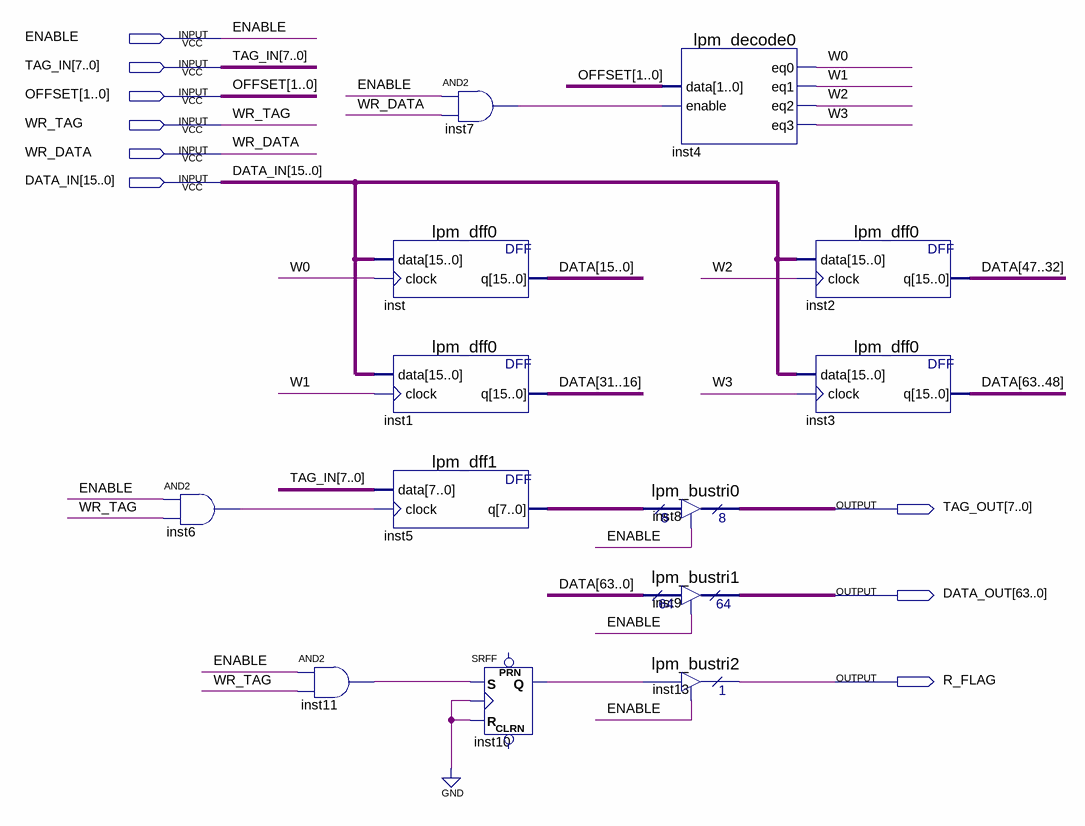
[diagram p0: schematic sheet]
// Quartus schematic CacheString.bdf as structural Verilog: 13 symbols, 9 pins
module CacheString (
  input  ENABLE,
  input  [7:0] TAG_IN,
  input  [1:0] OFFSET,
  input  WR_TAG,
  input  WR_DATA,
  input  [15:0] DATA_IN,
  output [7:0] TAG_OUT,
  output [63:0] DATA_OUT,
  output R_FLAG
);

  wire inst6_out, inst7_out, inst10_q, inst11_out, W0, W1, W2, W3;
  wire [7:0] inst5_q;
  wire [63:0] DATA;

  and inst6 (inst6_out, ENABLE, WR_TAG);
  and inst11 (inst11_out, ENABLE, WR_TAG);
  lpm_dff0 inst (.data(DATA_IN), .clock(W0), .q(DATA[15:0]));
  lpm_dff0 inst1 (.data(DATA_IN), .clock(W1), .q(DATA[31:16]));
  lpm_dff1 inst5 (.data(TAG_IN), .clock(inst6_out), .q(inst5_q));
  and inst7 (inst7_out, ENABLE, WR_DATA);
  SRFF inst10 (.S(inst11_out), .R(1'b0), .CLK(1'b0), .Q(inst10_q));  // open: PRN, CLRN
  lpm_decode0 inst4 (.data(OFFSET), .enable(inst7_out), .eq0(W0), .eq1(W1), .eq2(W2), .eq3(W3));
  lpm_bustri0 inst8 (.enabledt(ENABLE), .data(inst5_q), .tridata(TAG_OUT));
  lpm_bustri1 inst9 (.enabledt(ENABLE), .data(DATA), .tridata(DATA_OUT));
  lpm_bustri2 inst13 (.enabledt(ENABLE), .data(inst10_q), .tridata(R_FLAG));
  lpm_dff0 inst2 (.data(DATA_IN), .clock(W2), .q(DATA[47:32]));
  lpm_dff0 inst3 (.data(DATA_IN), .clock(W3), .q(DATA[63:48]));
endmodule
